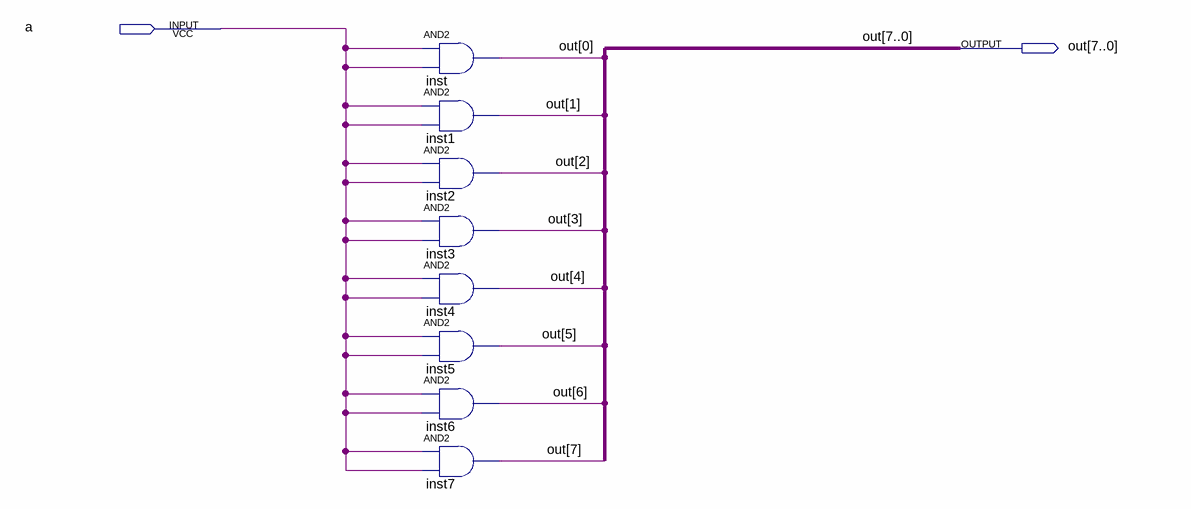
[diagram p0: schematic sheet]
// Quartus schematic 8bit_zero.bdf as structural Verilog: 8 symbols, 2 pins
module \8bit_zero  (
  input  a,
  output [7:0] out
);

  and inst (out[0], a, a);
  and inst1 (out[1], a, a);
  and inst2 (out[2], a, a);
  and inst3 (out[3], a, a);
  and inst4 (out[4], a, a);
  and inst5 (out[5], a, a);
  and inst6 (out[6], a, a);
  and inst7 (out[7], a, a);
endmodule
